# EAGLE schematic fullerton (EAGLE 7.6.0)

## Sheet 1 of 5: Power Supply
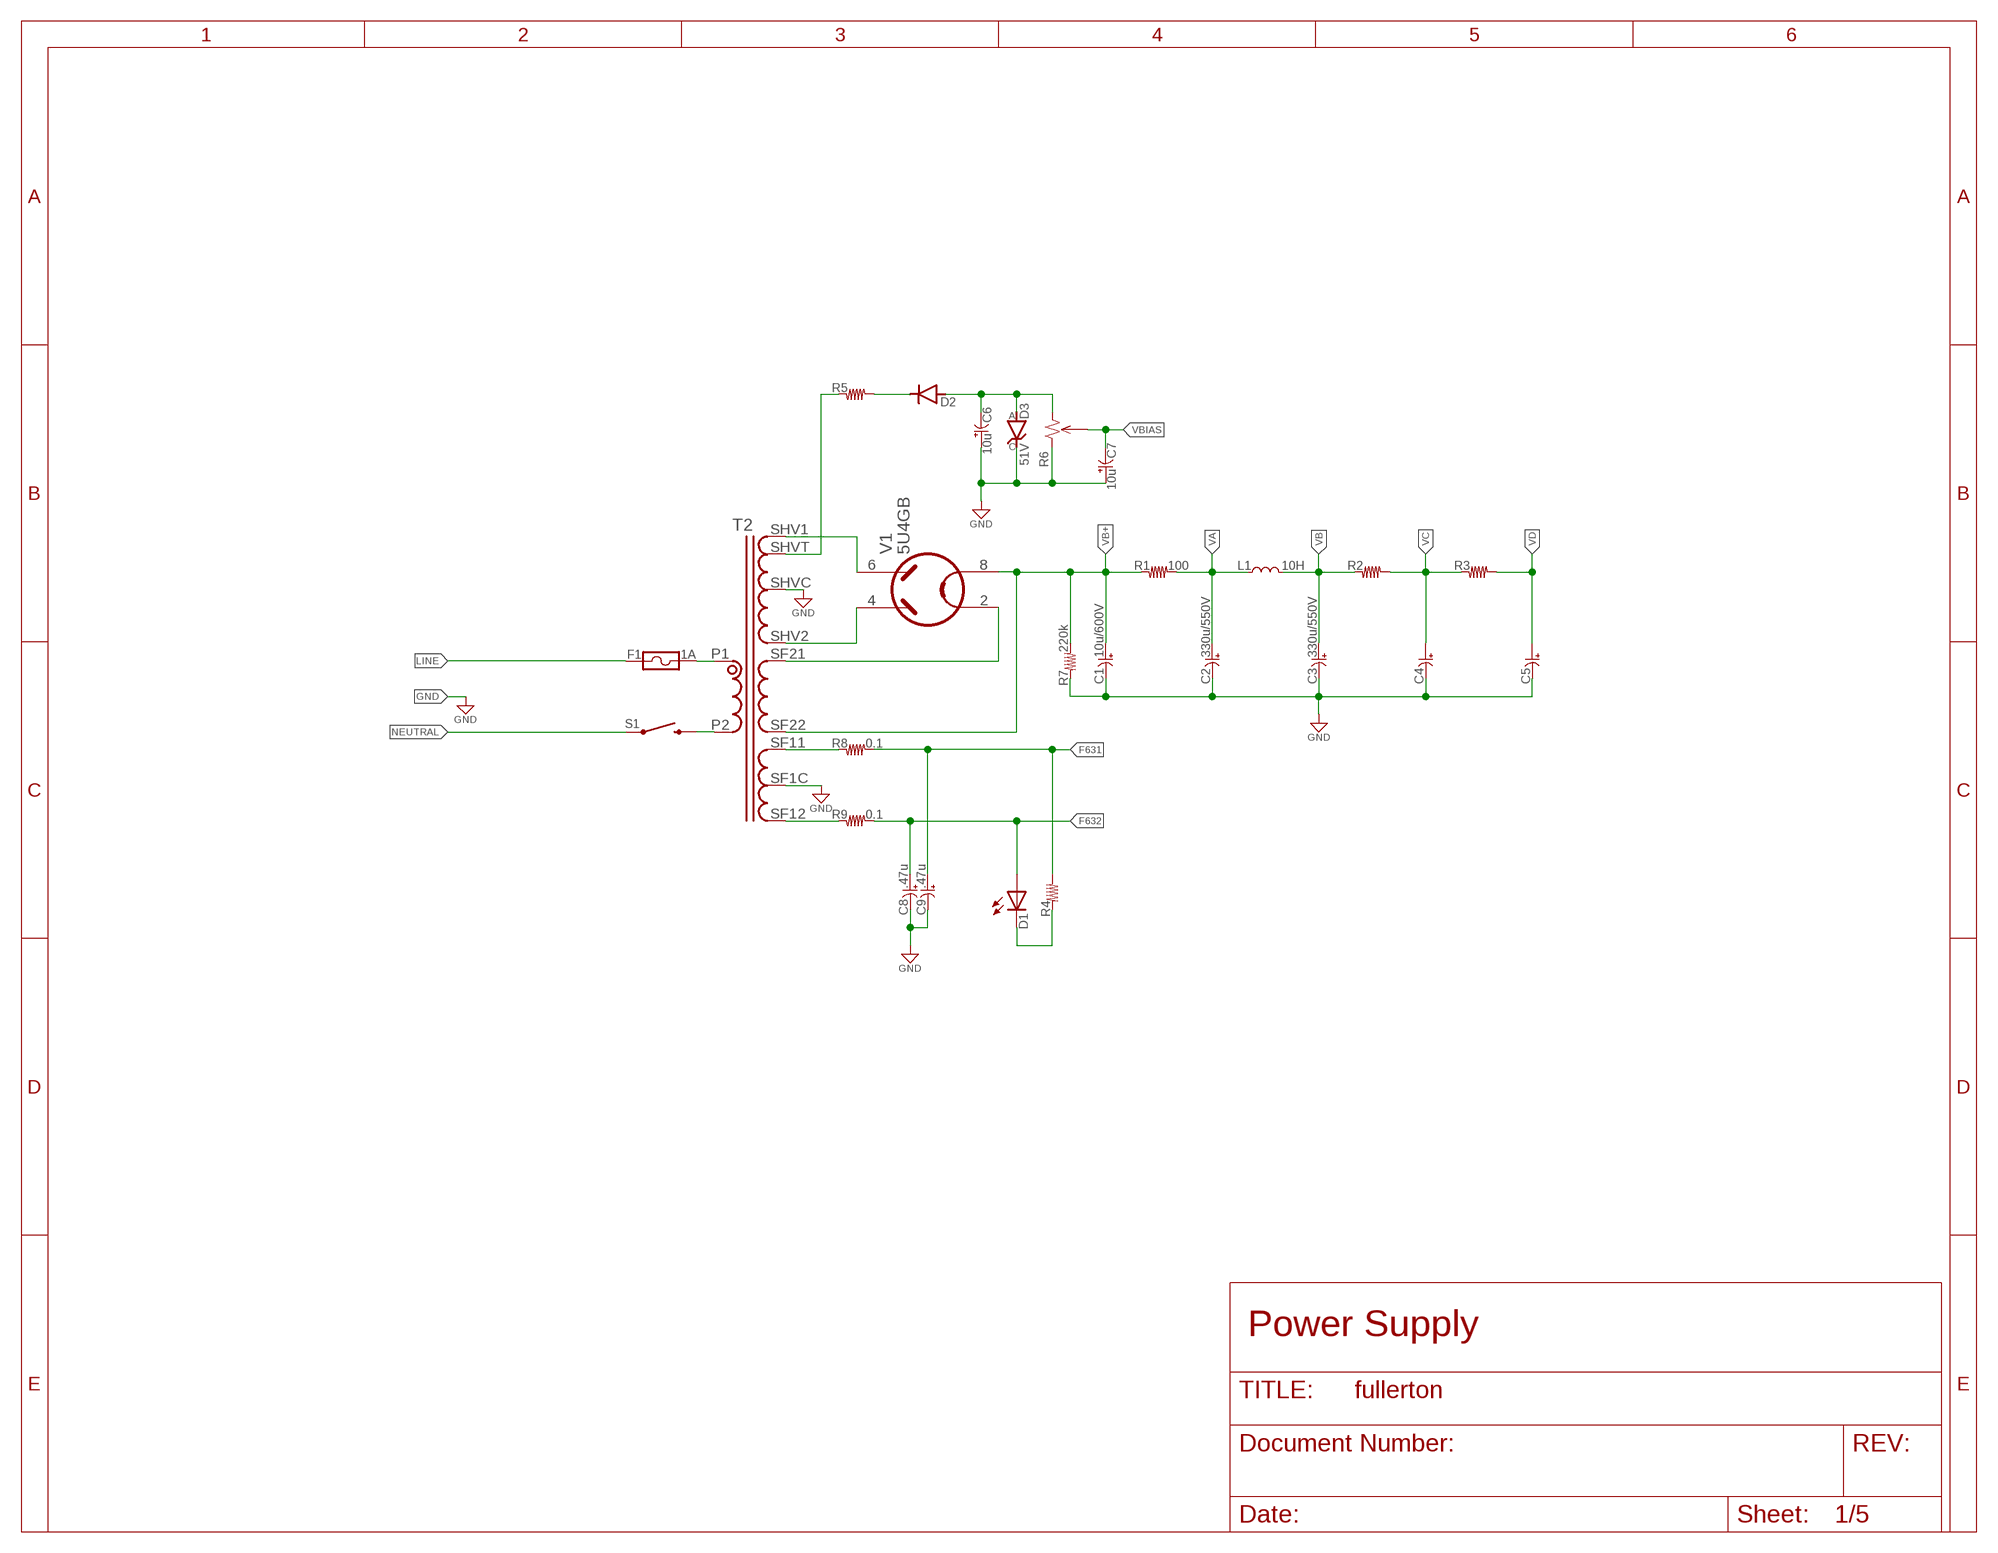
[diagram p0: schematic, sheet 1]

### Parts
C1  10u/600V  C-USC1210  [C1210]
C2  330u/550V  C-USC1210  [C1210]
C3  330u/550V  C-USC1210  [C1210]
C4  C-USC1210  [C1210]
C5  C-USC1210  [C1210]
C6  10u  C-USC1210  [C1210]
C7  10u  C-USC1210  [C1210]
C8  .47u  C-USC1210  [C1210]
C9  .47u  C-USC1210  [C1210]
D1  LED-3MM-0.1  [LED3MM]
D2  DIODE-1N4148  [DO-35]
D3  51V  ZENER-SOD323  [SOD-323]
F1  1A  FUSE-HOLDER-3557-2  [3557-2]
L1  10H  INDUCTOR-DR127  [DR127]
R1  100  R-US_R1206  [R1206]
R2  R-US_R1206  [R1206]
R3  R-US_R1206  [R1206]
R4  R-US_R1206  [R1206]
R5  R-US_R1206  [R1206]
R6  POTENTIOMETER  [CONN-.100-3]
R7  220k  R-US_R1206  [R1206]
R8  0.1  R-US_R1206  [R1206]
R9  0.1  R-US_R1206  [R1206]
S1  SWITCH-PANEL-SPST  [CONN-.100-2]
T2  TRANSFORMER-1-3C  [TRANSFORMER-1-3C]
V1  5U4GB  [OKTAL]

### Nets
F631: C9.1 R4.2 R8.2
F632: C8.1 D1.A R9.2
GND: C1.2 C2.2 C3.2 C4.2 C5.2 C6.1 C7.1 C8.2 C9.2 D3.C R6.1 R7.1 T2.SF1C T2.SHVC
LINE: F1.1@1 F1.1@2
N$1: T2.SHV1 V1.6(A2)
N$2: T2.SHV2 V1.4(A1)
N$3: T2.SF21 V1.2(H1)
N$4: R9.1 T2.SF12
N$5: R8.1 T2.SF11
N$9: D1.C R4.1
N$10: S1.2 T2.P2
N$11: F1.2@1 F1.2@2 T2.P1
N$12: R5.1 T2.SHVT
N$13: D2.C R5.2
N$14: C6.2 D2.A D3.A R6.3
NEUTRAL: S1.1
VA: C2.1 L1.2 R1.2
VB: C3.1 L1.1 R2.1
VB+: C1.1 R1.1 R7.2 T2.SF22 V1.8(H2)
VBIAS: C7.2 R6.2(W)
VC: C4.1 R2.2 R3.1
VD: C5.1 R3.2

## Sheet 2 of 5: Pre-Amplifier
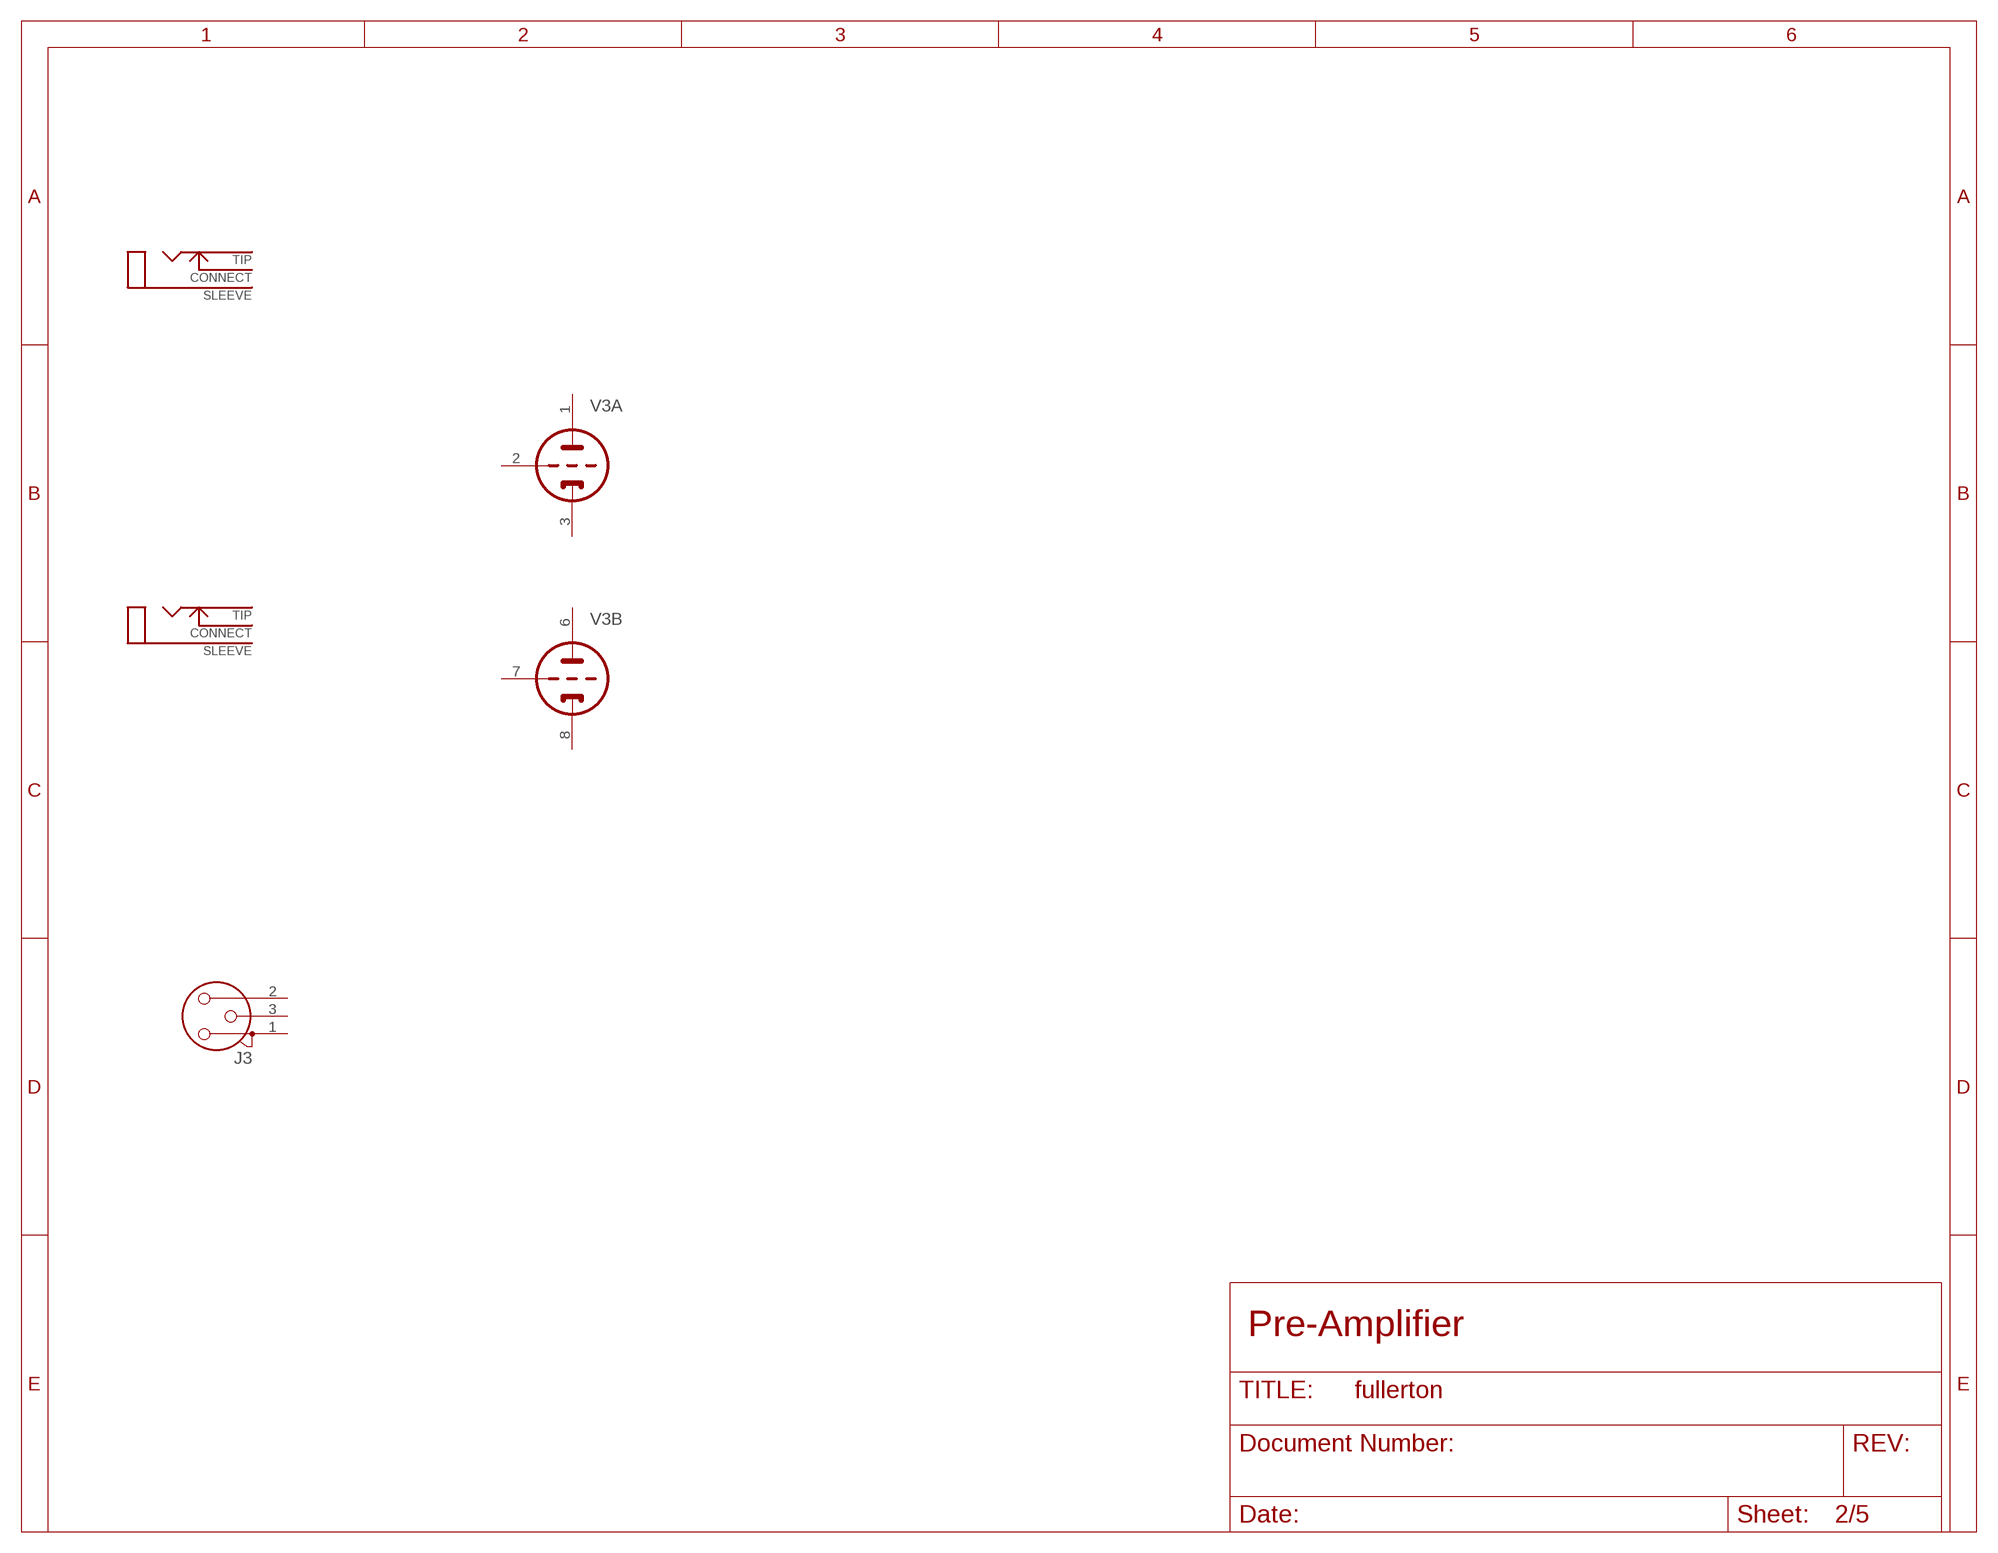
[diagram p1: schematic, sheet 2]

### Parts
J1  CONN-JACK-1/4"  [CONN-.100-3]
J2  CONN-JACK-1/4"  [CONN-.100-3]
J3  CONN-JACK-XLR-3  [CONN-.100-3]
V3  12AT7-P  [NOVAL]
Unconnected: J1.1(SLEEVE) J1.2(TIP) J1.3(CONNECT) J2.1(SLEEVE) J2.2(TIP) J2.3(CONNECT) J3.1 J3.2 J3.3 V3.1(A:TA) V3.2(A:TG) V3.3(A:TK) V3.4(":H1) V3.5(":H3) V3.6(B:TA) V3.7(B:TG) V3.8(B:TK) V3.9(":H2)

## Sheet 3 of 5: Mixer and Effects
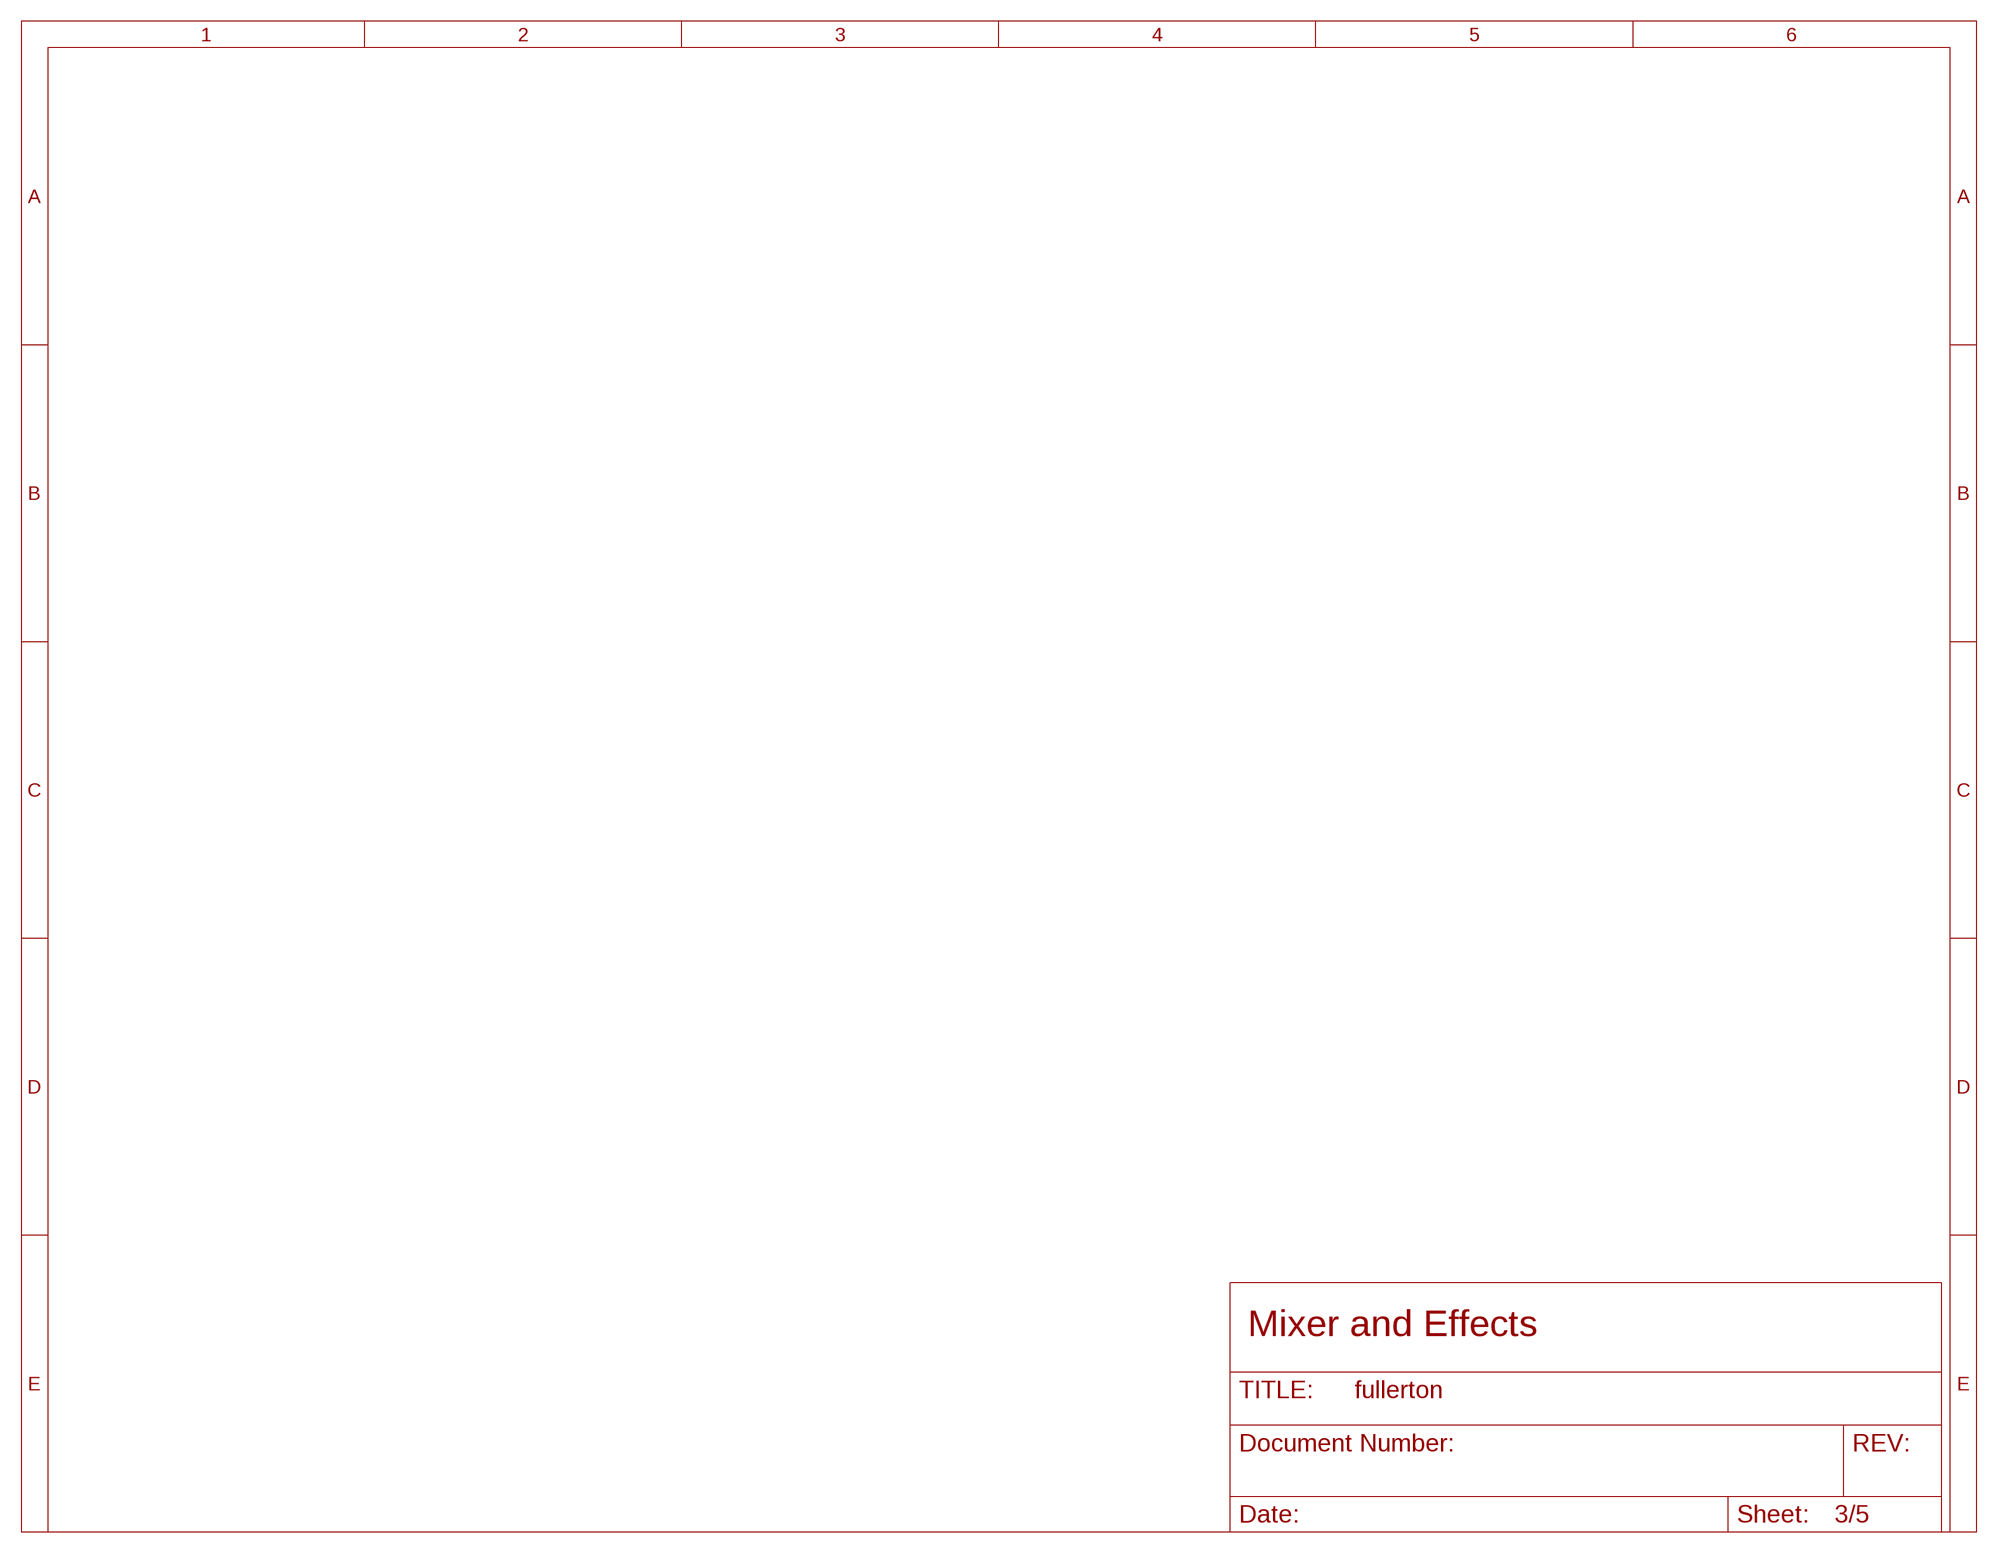
[diagram p2: schematic, sheet 3]

## Sheet 4 of 5: Power Amplifier - Small
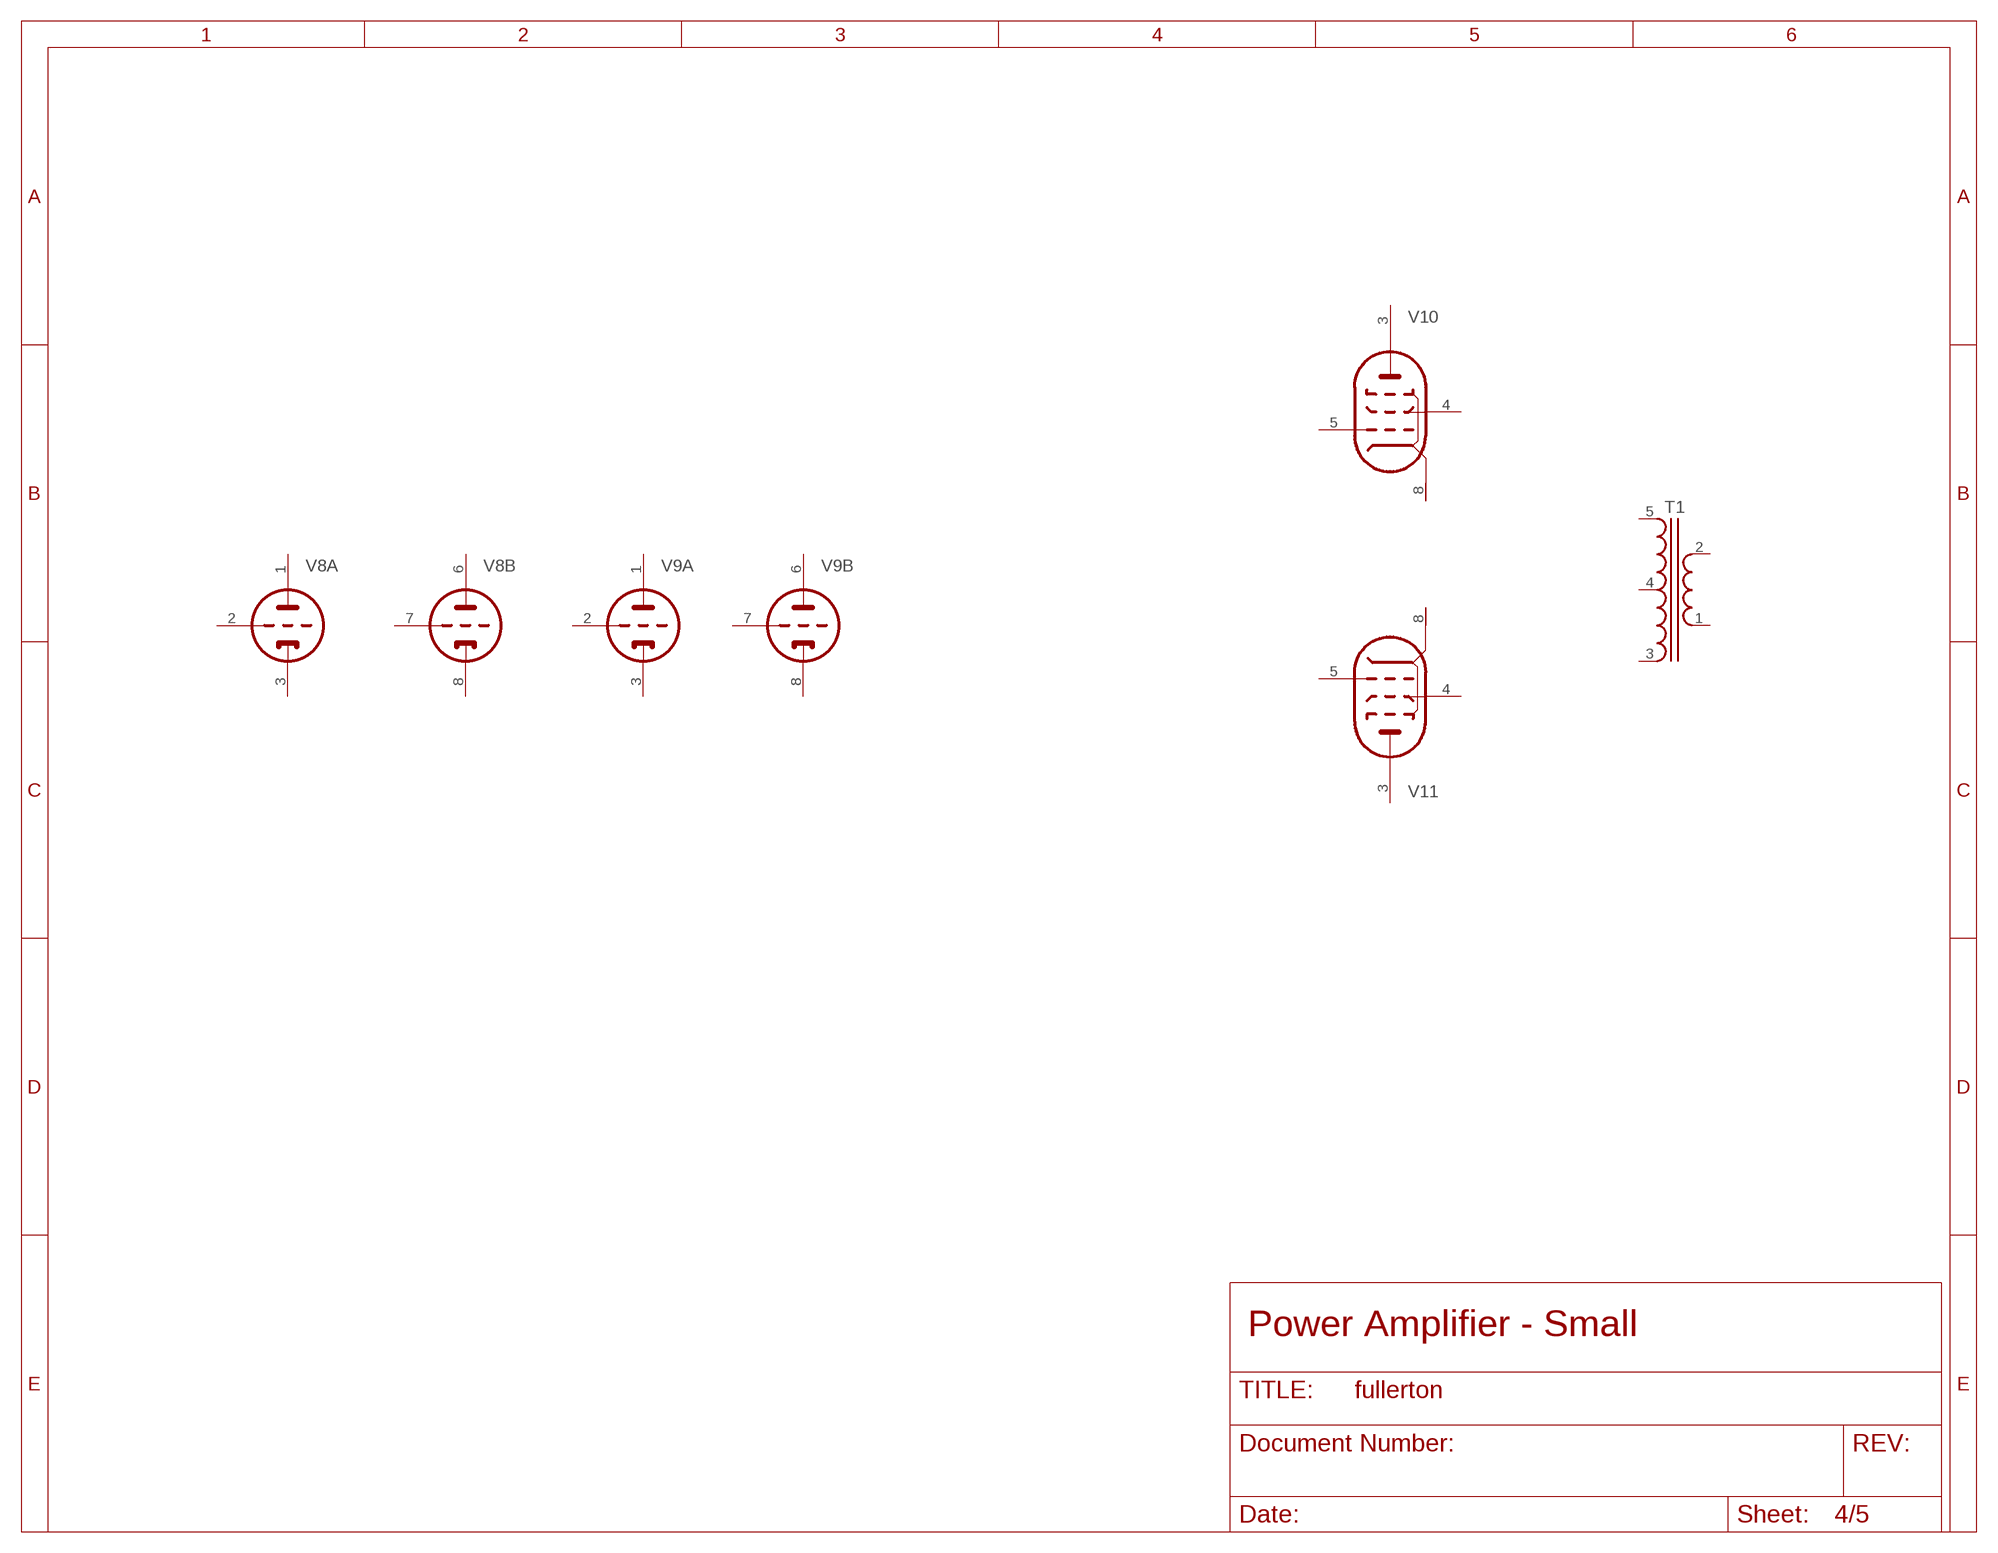
[diagram p3: schematic, sheet 4]

### Parts
T1  TRANSFORMER-3-2  [CONN-.100-5]
V8  12AT7-P  [NOVAL]
V9  12AT7-P  [NOVAL]
V10  6K6GT-P  [OKTAL]
V11  6K6GT-P  [OKTAL]
Unconnected: T1.1(S1) T1.2(S2) T1.3(P1) T1.4(PCT) T1.5(P2) V8.1(A:TA) V8.2(A:TG) V8.3(A:TK) V8.4(":H1) V8.5(":H3) V8.6(B:TA) V8.7(B:TG) V8.8(B:TK) V8.9(":H2) V9.1(A:TA) V9.2(A:TG) V9.3(A:TK) V9.4(":H1) V9.5(":H3) V9.6(B:TA) V9.7(B:TG) V9.8(B:TK) V9.9(":H2) V10.2(H1) V10.3(PA) V10.4(PSG) V10.5(PG) V10.7(H2) V10.8(PK) V11.2(H1) V11.3(PA) V11.4(PSG) V11.5(PG) V11.7(H2) V11.8(PK)

## Sheet 5 of 5: Power Amplifier - Large
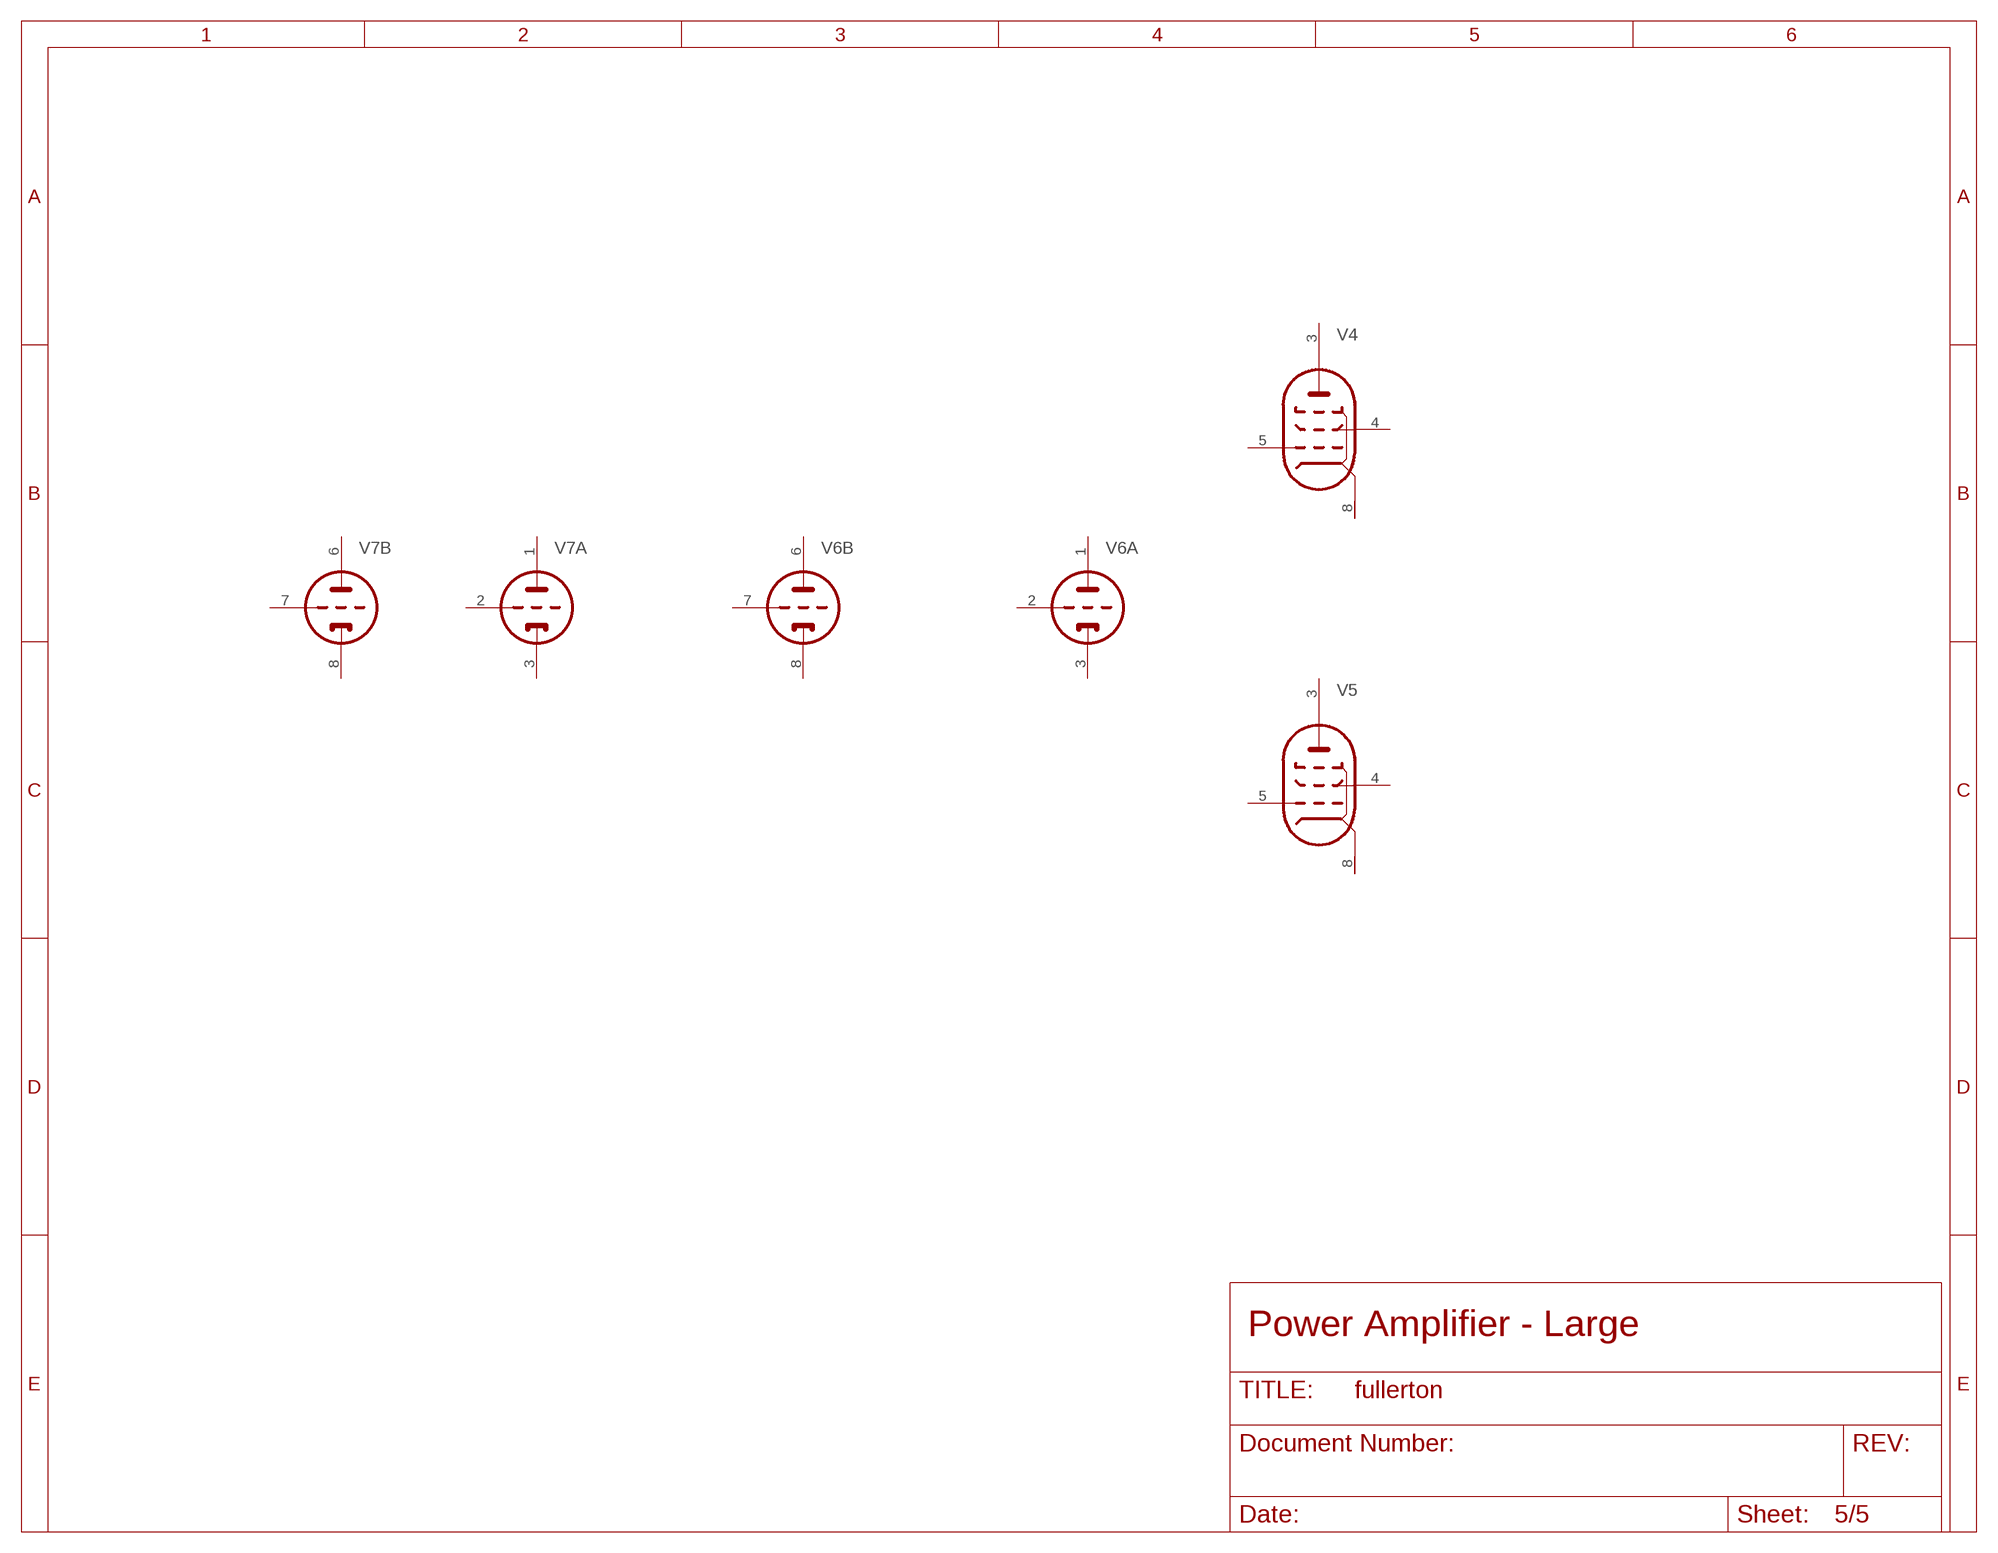
[diagram p4: schematic, sheet 5]

### Parts
V4  6L6GC-P  [OKTAL]
V5  6L6GC-P  [OKTAL]
V6  12AT7-P  [NOVAL]
V7  12AT7-P  [NOVAL]
Unconnected: V4.2(H1) V4.3(PA) V4.4(PSG) V4.5(PG) V4.7(H2) V4.8(PK) V5.2(H1) V5.3(PA) V5.4(PSG) V5.5(PG) V5.7(H2) V5.8(PK) V6.1(A:TA) V6.2(A:TG) V6.3(A:TK) V6.4(":H1) V6.5(":H3) V6.6(B:TA) V6.7(B:TG) V6.8(B:TK) V6.9(":H2) V7.1(A:TA) V7.2(A:TG) V7.3(A:TK) V7.4(":H1) V7.5(":H3) V7.6(B:TA) V7.7(B:TG) V7.8(B:TK) V7.9(":H2)

## Library data of the parts
C1-C9 = holla:C
D1 = holla:LED
D2 = holla:DIODE
D3 = holla:ZENER: Zener
F1 = holla:FUSE-HOLDER
J1 J2 = holla:CONN-JACK-1/4": Connector - 1/4" Jack reference http://gaussmarkov.net/wordpress/parts/connectors/14-phone-jacks-and-plugs/
J3 = holla:CONN-JACK-XLR-3
L1 = holla:INDUCTOR
R1-R5 R7-R9 = holla:R
R6 = holla:POTENTIOMETER
S1 = holla:SWITCH-PANEL-SPST
T1 = holla:TRANSFORMER-3-2
T2 = holla:TRANSFORMER-1-3C
V1 = tubes:5U4GB
V3 V6-V9 = tubes:12AT7-P
V4 V5 = tubes:6L6GC-P
V10 V11 = tubes:6K6GT-P